# Altium project PR003.PrjPcb (part 2 of 11)

## Sheet TypeC_USB2.0.SchDoc
size A3; SheetNumber: 5; SheetTotal: 16
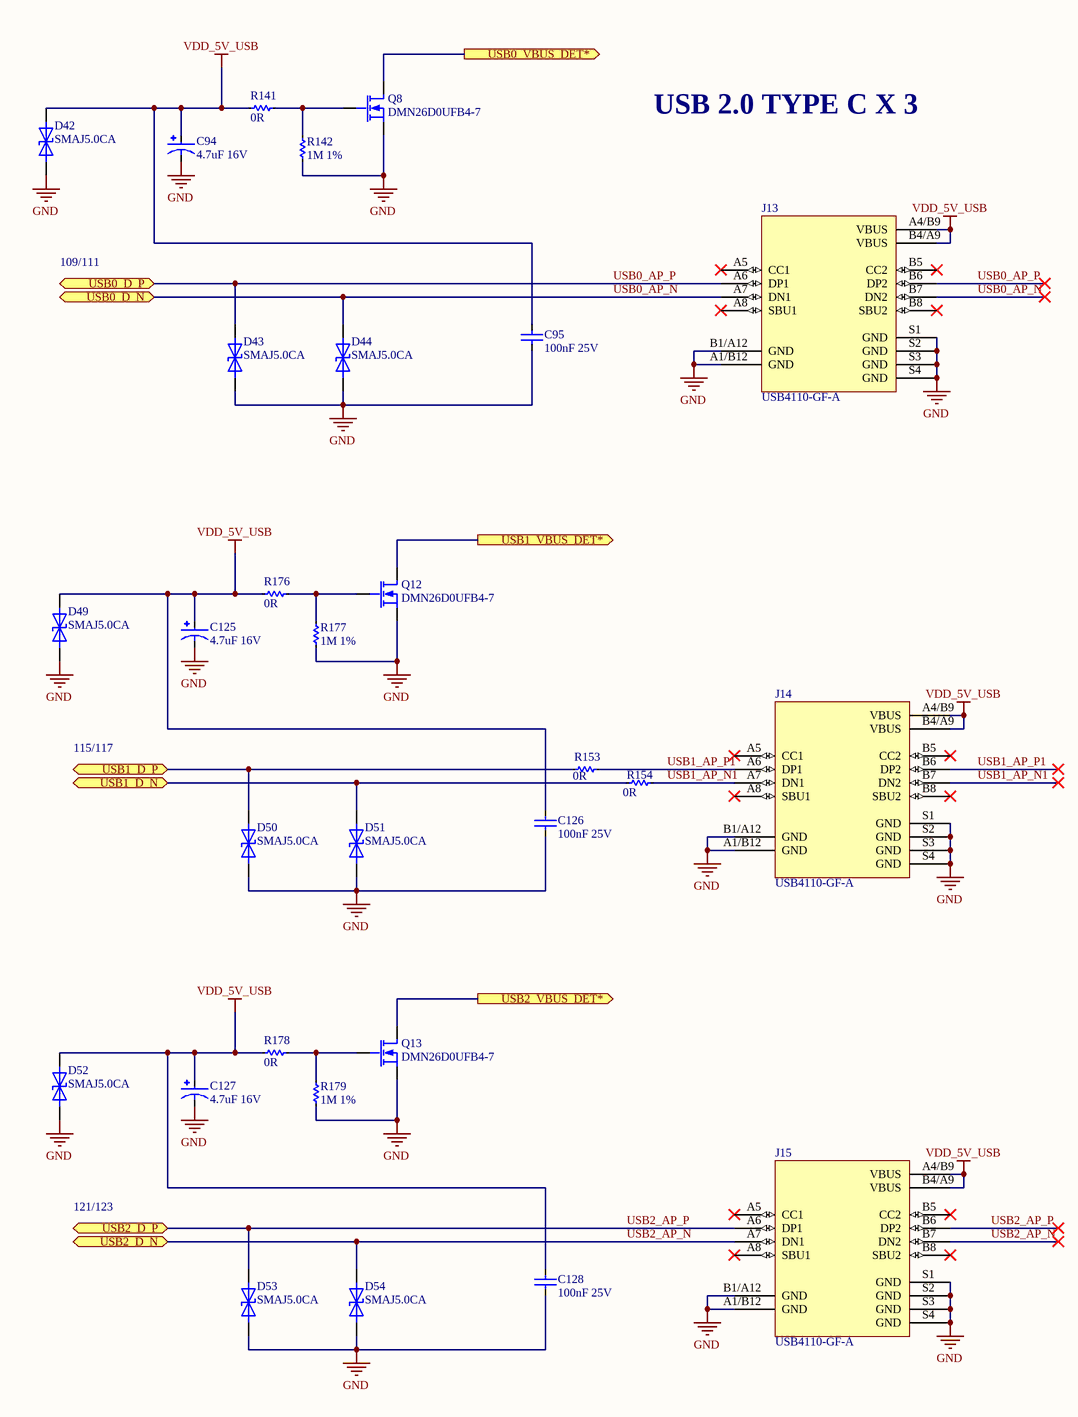
[diagram p3: TypeC_USB2.0.SchDoc]

### Parts
C94  4.7uF 16V  [C1206_TANTALUM]
C95  100nF 25V  [C0402]
C125  4.7uF 16V  [C1206_TANTALUM]
C126  100nF 25V  [C0402]
C127  4.7uF 16V  [C1206_TANTALUM]
C128  100nF 25V  [C0402]
D42  SMAJ5.0CA  [DO-214AC]
D43  SMAJ5.0CA  [DO-214AC]
D44  SMAJ5.0CA  [DO-214AC]
D49  SMAJ5.0CA  [DO-214AC]
D50  SMAJ5.0CA  [DO-214AC]
D51  SMAJ5.0CA  [DO-214AC]
D52  SMAJ5.0CA  [DO-214AC]
D53  SMAJ5.0CA  [DO-214AC]
D54  SMAJ5.0CA  [DO-214AC]
J13  USB4110-GF-A  [USB4110-GF-A]
J14  USB4110-GF-A  [USB4110-GF-A]
J15  USB4110-GF-A  [USB4110-GF-A]
Q8  DMN26D0UFB4-7  [DFN1006-3]
Q12  DMN26D0UFB4-7  [DFN1006-3]
Q13  DMN26D0UFB4-7  [DFN1006-3]
R141  0R  [R0603]
R142  1M 1%  [R0402]
R153  0R  [R0402]
R154  0R  [R0402]
R176  0R  [R0603]
R177  1M 1%  [R0402]
R178  0R  [R0603]
R179  1M 1%  [R0402]

### Ports
USB0_D_N (bidir), USB0_D_P (bidir), USB0_VBUS_DET* (out), USB1_D_N (bidir), USB1_D_P (bidir), USB1_VBUS_DET* (out), USB2_D_N (bidir), USB2_D_P (bidir), USB2_VBUS_DET* (out)

### Nets
GND: C94.2(-) C95.1 C125.2(-) C126.1 C127.2(-) C128.1 D42.C D43.C D44.C D49.C D50.C D51.C D52.C D53.C D54.C J13.A1/B12(GND) J13.B1/A12(GND) J13.S1(GND) J13.S2(GND) J13.S3(GND) J13.S4(GND) J14.A1/B12(GND) J14.B1/A12(GND) J14.S1(GND) J14.S2(GND) J14.S3(GND) J14.S4(GND) J15.A1/B12(GND) J15.B1/A12(GND) J15.S1(GND) J15.S2(GND) J15.S3(GND) J15.S4(GND) Q8.2(S) Q12.2(S) Q13.2(S) R142.1 R177.1 R179.1
VDD_5V_USB: C94.1(+1) C95.2 C125.1(+1) C126.2 C127.1(+1) C128.2 D42.A D49.A D52.A J13.A4/B9(VBUS) J13.B4/A9(VBUS) J14.A4/B9(VBUS) J14.B4/A9(VBUS) J15.A4/B9(VBUS) J15.B4/A9(VBUS) R141.1 R176.1 R178.1
USB0_AP_N: D44.A J13.A7(DN1) J13.B7(DN2) ; port USB0_D_N
USB0_AP_P: D43.A J13.A6(DP1) J13.B6(DP2) ; port USB0_D_P
USB1_AP_N1: J14.A7(DN1) J14.B7(DN2) R154.2
USB1_AP_P1: J14.A6(DP1) J14.B6(DP2) R153.2
USB1_D_N: D51.A R154.1 ; port USB1_D_N
USB1_D_P: D50.A R153.1 ; port USB1_D_P
USB2_AP_N: D54.A J15.A7(DN1) J15.B7(DN2) ; port USB2_D_N
USB2_AP_P: D53.A J15.A6(DP1) J15.B6(DP2) ; port USB2_D_P
NetJ10_87: Q8.3(D) ; port USB0_VBUS_DET*
NetJ10_128: Q12.3(D) ; port USB1_VBUS_DET*
NetJ10_130: Q13.3(D) ; port USB2_VBUS_DET*
NetQ8_1: Q8.1(G) R141.2 R142.2
NetQ12_1: Q12.1(G) R176.2 R177.2
NetQ13_1: Q13.1(G) R178.2 R179.2

Not connected (* = marked no-connect by the designer): J13 A5(CC1)* A8(SBU1)* B5(CC2)* B8(SBU2)*; J14 A5(CC1)* A8(SBU1)* B5(CC2)* B8(SBU2)*; J15 A5(CC1)* A8(SBU1)* B5(CC2)* B8(SBU2)*

### Notes on the sheet
- USB 2.0 TYPE C X 3
- 109/111
- 115/117
- 121/123

### Library data of the parts
C94 C125 C127 = TAJA475K016RNJ: Cap Tant Solid 4.7uF 16V A CASE 10%( 3.2 X 1.6 X 1.6mm) Inward L SMD 3216-18 4 Ohm 125C T/R; Manufacturer: Kyocera AVX; Dielectric Material: Tantalum; ESR (Equivalent Series Resistance): 4R; Leakage Current: 800nA; Polarity: Polar; Dissipation Factor: 6%; Supplier 1: Digi-Key; Manufacturer Part Number: TAJA475K016RNJ; RoHS: Yes; Category: Tantalum Capacitors; Stock 1: 746000; Pricing 1: 2000=0.09306, 4000=0.08789, 10000=0.08272, 14000=0.08014, 50000=0.07238, 100000=0.06721 (USD); Mount: Surface Mount,PCB; Case/Package: 1206; Number of Pins: 2; Case Code (Metric): 3216; Case Code (Imperial): 1206; Min Operating Temperature: -55°C; Max Operating Temperature: 125°C; Package Quantity: 2000; Capacitance: 4.7uF; Voltage Rating: 16V; Tolerance: 10%; Packaging: Tape and Reel; Voltage Rating (DC): 16V; Termination: SMD/SMT; Voltage: 16V; Features: General Purpose; Series: TAJ; Construction: Flat; Length: 3.2mm; Width: 1.6mm; Height: 1.6mm; Height - Seated (Max): 0.071inch; Depth: 1.6mm; Lead Pitch: 1.1mm; Radiation Hardening: No; Reach SVHC Compliant: Yes; Lead Free: Lead Free; RoHS Compliant: Yes; ComponentLink1URL: https://datasheet.ciiva.com/18710/taj-eng-18710646.pdf?src-supplier=Distrelec; ComponentLink1Description: https://datasheet.ciiva.com/18710/taj-eng-18710646.pdf?src-supplier=Distrelec; ComponentLink2URL: https://datasheet.ciiva.com/7914/taj-7914556.pdf?src-supplier=Element14; ComponentLink2Description: https://datasheet.ciiva.com/7914/taj-7914556.pdf?src-supplier=Element14; ComponentLink3URL: https://datasheet.ciiva.com/7914/taj-7914558.pdf?src-supplier=Element14; ComponentLink3Description: https://datasheet.ciiva.com/7914/taj-7914558.pdf?src-supplier=Element14; ComponentLink4URL: https://datasheet.ciiva.com/7914/1680476-7914555.pdf?src-supplier=Element14; ComponentLink4Description: https://datasheet.ciiva.com/7914/1680476-7914555.pdf?src-supplier=Element14; ComponentLink5URL: https://datasheet.ciiva.com/5934/13070-5934925.pdf?src-supplier=Farnell; ComponentLink5Description: https://datasheet.ciiva.com/5934/13070-5934925.pdf?src-supplier=Farnell; ComponentLink6URL: https://datasheet.ciiva.com/7914/13070-7914557.pdf?src-supplier=Element14; ComponentLink6Description: https://datasheet.ciiva.com/7914/13070-7914557.pdf?src-supplier=Element14; ComponentLink7URL: https://datasheet.ciiva.com/263/taj-263377.pdf?src-supplier=Digi-Key; ComponentLink7Description: https://datasheet.ciiva.com/263/taj-263377.pdf?src-supplier=Digi-Key; ComponentLink8URL: https://datasheet.ciiva.com/263/taj-263376.pdf?src-supplier=Digi-Key; ComponentLink8Description: https://datasheet.ciiva.com/263/taj-263376.pdf?src-supplier=Digi-Key; ComponentLink9URL: https://datasheet.ciiva.com/263/taj-263378.pdf?src-supplier=Digi-Key; ComponentLink9Description: https://datasheet.ciiva.com/263/taj-263378.pdf?src-supplier=Digi-Key; Supplier Part Number 1: 478-3868-2-ND
C95 C126 C128 = 04023C104KAT2A: 0402 100 nF 25 V ±10 % Tolerance X7R Surface Mount Multilayer Ceramic Capacitor; Manufacturer: Kyocera AVX; Tolerance: 10%; Supplier 1: Digi-Key; Manufacturer Part Number: 04023C104KAT2A; RoHS: Yes; Category: Ceramic Capacitors; Stock 1: 3248475; Pricing 1: 1=0.10000, 10=0.03300, 50=0.01820, 100=0.01480, 500=0.01060, 1000=0.00833, 2500=0.00758, 5000=0.00697 (USD); Mount: Surface Mount; Case/Package: 0402; Number of Pins: 2; Case Code (Metric): 1005; Case Code (Imperial): 0402; Min Operating Temperature: -55°C; Max Operating Temperature: 125°C; Capacitance: 100nF; Packaging: Cut Tape; Dielectric: X7R; Voltage Rating (DC): 25V; Voltage Rating: 25V; Package Quantity: 1; Termination: SMD/SMT; Voltage: 25V; Series: -; Construction: Flat; Length: 1mm; Width: 1mm; Thickness: 0.022inch; Depth: 0.5mm; Radiation Hardening: No; Reach SVHC Compliant: Yes; Lead Free: Lead Free; RoHS Compliant: Yes; ComponentLink1URL: https://datasheet.ciiva.com/1123/1679506-1123344.pdf?src-supplier=Element14; ComponentLink1Description: https://datasheet.ciiva.com/1123/1679506-1123344.pdf?src-supplier=Element14; ComponentLink2URL: https://datasheet.ciiva.com/7614/cx7r-7614663.pdf?src-supplier=Digi-Key; ComponentLink2Description: https://datasheet.ciiva.com/7614/cx7r-7614663.pdf?src-supplier=Digi-Key; ComponentLink3URL: https://datasheet.ciiva.com/7709/1679506-7709527.pdf?src-supplier=Element14; ComponentLink3Description: https://datasheet.ciiva.com/7709/1679506-7709527.pdf?src-supplier=Element14; ComponentLink4URL: https://datasheet.ciiva.com/6265/cx7r-6265272.pdf?src-supplier=Digi-Key; ComponentLink4Description: https://datasheet.ciiva.com/6265/cx7r-6265272.pdf?src-supplier=Digi-Key; ComponentLink5URL: https://datasheet.ciiva.com/14906/cx7r-14906223.pdf?src-supplier=Digi-Key; ComponentLink5Description: https://datasheet.ciiva.com/14906/cx7r-14906223.pdf?src-supplier=Digi-Key; Supplier Part Number 1: 478-7868-1-ND
D42-D44 D49-D54 = SMAJ5.0CA: Transient Voltage Suppressor, TVS, SMAJ Series, Bidirectional, 5 V, DO-214AC, 2, 6.4 V RoHS Compliant: Yes; Manufacturer: Littelfuse; Reverse Breakdown Voltage: 6.4V; Operating Supply Voltage: 5V; Max Surge Current: 43.5A; Number of Elements: 1; Clamping Voltage: 9.2V; Peak Pulse Power: 400W; Power Line Protection: No; Test Current: 10mA; Max Reverse Leakage Current: 800uA; Max Breakdown Voltage: 7V; Max Power Dissipation: 3.3W; Element Configuration: Single; Leakage Current: 1.6mA; Capacitance: 1.05nF; Diode Type: ZENER; Supplier 1: Digi-Key; Manufacturer Part Number: SMAJ5.0CA; RoHS: Yes; Category: TVS Diodes; Stock 1: 526420; Pricing 1: 1=0.43000, 10=0.32000, 100=0.19950, 500=0.13650, 1000=0.10500, 2000=0.09450 (USD); Mount: Surface Mount; Case/Package: DO-214AC; Number of Pins: 2; Min Operating Temperature: -65°C; Max Operating Temperature: 150°C; Package Quantity: 5000; Direction: Bidirectional; Packaging: Tape and Reel; Number of Bidirectional Channels: 1; Reverse Standoff Voltage: 5V; Min Breakdown Voltage: 6.4V; Breakdown Voltage: 6.4V; Number of Channels: 1; Polarity: Bidirectional; Termination: SMD/SMT; Peak Pulse Current: 43.5A; Power Dissipation: 400W; Voltage Rating (DC): 5V; Max Output Current: 43.5A; Resistor Type: Zener; Series: SMAJ; Clamping Voltage-Max: 9.2V; Length: 4.5mm; Width: 2.79mm; Height: 2.087mm; Radiation Hardening: No; Reach SVHC Compliant: Yes; Lead Free: Lead Free; RoHS Compliant: Yes; ComponentLink1URL: https://datasheet.ciiva.com/25624/0900766b810f4edb-25624837.pdf?src-supplier=Rs; ComponentLink1Description: https://datasheet.ciiva.com/25624/0900766b810f4edb-25624837.pdf?src-supplier=Rs; ComponentLink2URL: https://datasheet.ciiva.com/28473/607617-28473438.pdf?src-supplier=Element14; ComponentLink2Description: https://datasheet.ciiva.com/28473/607617-28473438.pdf?src-supplier=Element14; ComponentLink3URL: https://datasheet.ciiva.com/16206/littelfuse-tvs-diode-smaj-16206104.pdf?src-supplier=Future+Electronics; ComponentLink3Description: https://datasheet.ciiva.com/16206/littelfuse-tvs-diode-smaj-16206104.pdf?src-supplier=Future+Electronics; ComponentLink4URL: https://datasheet.ciiva.com/331/littelfuse-tvs-diode-smaj-datasheet-pdf-331055.pdf?src-supplier=Digi-Key; ComponentLink4Description: https://datasheet.ciiva.com/331/littelfuse-tvs-diode-smaj-datasheet-pdf-331055.pdf?src-supplier=Digi-Key; ComponentLink5URL: https://datasheet.ciiva.com/331/littelfuse-tvs-diode-smaj-datasheet-pdf-331056.pdf?src-supplier=Digi-Key; ComponentLink5Description: https://datasheet.ciiva.com/331/littelfuse-tvs-diode-smaj-datasheet-pdf-331056.pdf?src-supplier=Digi-Key; ComponentLink6URL: https://datasheet.ciiva.com/331/littelfuse-tvs-diode-smaj-datasheet-pdf-331054.pdf?src-supplier=Digi-Key; ComponentLink6Description: https://datasheet.ciiva.com/331/littelfuse-tvs-diode-smaj-datasheet-pdf-331054.pdf?src-supplier=Digi-Key; Supplier Part Number 1: SMAJ5.0CALFCT-ND
J13-J15 = USB4110-GF-A: Conn USB 2.0 Type C RCP 16 POS 0.3mm/0.5mm Solder ST SMD 16 Terminal 1 Port T/R; Manufacturer: Global Connector Technology; Gender: Receptacle; Mating Cycles: 10000; Shielding: Shielded; Number of Ports: 1; Supplier 1: Farnell; Manufacturer Part Number: USB4110-GF-A; RoHS: No; Category: USB Connectors; Stock 1: 3190; Pricing 1: 1=1.17000, 10=1.04000, 25=0.97800, 50=0.93500, 100=0.89200, 250=0.82000, 500=0.74800 (GBP); Mount: Surface Mount,Through Hole,Horizontal; Contact Plating: Gold; Insulation Color: Black; Min Operating Temperature: -40°C; Max Operating Temperature: 85°C; Connector Type: USB; Series: USB4110; Termination: Solder; Flammability Rating: UL94 V-0; ComponentLink1URL: https://gct.co/files/drawings/usb4110.pdf?src-supplier=Digi-Key; ComponentLink1Description: https://gct.co/files/drawings/usb4110.pdf?src-supplier=Digi-Key; Supplier Part Number 1: 3583367
Q8 Q12 Q13 = DMN26D0UFB4-7: Single N-Channel 20 V 350 mW Silicon Surface Mount Mosfet - DFN-3; Manufacturer: Diodes; Rise Time: 7.9ns; Rds On Max: 3R; Input Capacitance: 14.1pF; Continuous Drain Current (ID): 240mA; Drain to Source Resistance: 1.8R; Power Dissipation: 350mW; Turn-Off Delay Time: 13.4ns; Drain to Source Voltage (Vdss): 20V; Turn-On Delay Time: 3.8ns; Fall Time: 15.2ns; Number of Elements: 1; Gate to Source Voltage (Vgs): 10V; On-State Resistance: 10R; FET Type: 1 N-Channel; Supplier 1: Mouser; Manufacturer Part Number: DMN26D0UFB4-7; RoHS: Yes; Category: MOSFETs; Stock 1: 21043; Pricing 1: 1=0.38000, 10=0.32100, 50=0.32100, 100=0.17000, 1000=0.07700, 10000=0.05000 (USD); Mount: Surface Mount; Case/Package: DFN; Number of Pins: 3; Min Operating Temperature: -55°C; Max Operating Temperature: 150°C; Packaging: Tape and Reel; Package Quantity: 3000; Max Power Dissipation: 350mW; Element Configuration: Single; Number of Channels: 1; Polarity: N-CHANNEL; Series: -; Drain-source On Resistance-Max: 10R; Length: 1.05mm; Width: 0.65mm; Height: 0.35mm; Radiation Hardening: No; Reach SVHC Compliant: Yes; Lead Free: Lead Free; RoHS Compliant: Yes; ComponentLink1URL: https://datasheet.ciiva.com/4443/ds31775-89139-4443083.pdf?src-supplier=Mouser; ComponentLink1Description: https://datasheet.ciiva.com/4443/ds31775-89139-4443083.pdf?src-supplier=Mouser; ComponentLink2URL: https://datasheet.ciiva.com/11176/ds31775-11176556.pdf?src-supplier=Avnet; ComponentLink2Description: https://datasheet.ciiva.com/11176/ds31775-11176556.pdf?src-supplier=Avnet; ComponentLink3URL: https://datasheet.ciiva.com/16434/ds31775-16434037.pdf?src-supplier=Future+Electronics; ComponentLink3Description: https://datasheet.ciiva.com/16434/ds31775-16434037.pdf?src-supplier=Future+Electronics; ComponentLink4URL: https://datasheet.ciiva.com/48532/ds31775-48532486.pdf?src-supplier=Avnet; ComponentLink4Description: https://datasheet.ciiva.com/48532/ds31775-48532486.pdf?src-supplier=Avnet; ComponentLink5URL: https://datasheet.ciiva.com/934/ds31775-934573.pdf?src-supplier=Digi-Key; ComponentLink5Description: https://datasheet.ciiva.com/934/ds31775-934573.pdf?src-supplier=Digi-Key; ComponentLink6URL: https://datasheet.ciiva.com/934/ds31775-934574.pdf?src-supplier=Digi-Key; ComponentLink6Description: https://datasheet.ciiva.com/934/ds31775-934574.pdf?src-supplier=Digi-Key; ComponentLink7URL: https://datasheet.ciiva.com/934/ds31775-934572.pdf?src-supplier=Digi-Key; ComponentLink7Description: https://datasheet.ciiva.com/934/ds31775-934572.pdf?src-supplier=Digi-Key; Supplier Part Number 1: 621-DMN26D0UFB4-7
R141 R176 R178 = CR0603-J/-000ELF: RES SMD 0 OHM JUMPER 1/10W 0603; Manufacturer: Bourns; Resistance: 0mR; Power Rating: 100mW; Tolerance: 1%; Voltage Rating: 50V; Temperature Coefficient: 500ppm/°C; Resistance Tolerance: 5%; Supplier 1: Digi-Key; Manufacturer Part Number: CR0603-J/-000ELF; RoHS: Yes; Category: Chip SMD Resistors; Stock 1: 1690954; Pricing 1: 1=0.10000, 10=0.01300, 25=0.00960, 50=0.00720, 100=0.00540, 250=0.00408, 500=0.00328, 1000=0.00241 (USD); Mount: Surface Mount; Case/Package: 0603; Number of Pins: 2; Case Code (Imperial): 0603; Case Code (Metric): 1608; Contact Plating: Tin; Min Operating Temperature: -55°C; Max Operating Temperature: 155°C; Packaging: Tape and Reel; Package Quantity: 5000; Resistor Type: Thick Film; Termination: SMD/SMT; Max Power Dissipation: 100mW; Voltage Rating (DC): 50V; Series: CR0603; Technology: THICK FILM; Construction: Rectangular; Features: Moisture Resistant; Number of Terminations: 2; Length: 1.6mm; Width: 0.8mm; Height: 0.45mm; Depth: 0.8mm; Thickness: 457um; Radiation Hardening: No; Reach SVHC Compliant: Yes; Military Standard: Not; RoHS Compliant: Yes; ComponentLink1URL: https://datasheet.ciiva.com/11809/0900766b80fcdb72-11809586.pdf?src-supplier=RSComponents; ComponentLink1Description: https://datasheet.ciiva.com/11809/0900766b80fcdb72-11809586.pdf?src-supplier=RSComponents; ComponentLink2URL: https://datasheet.ciiva.com/7001/1902866-7001645.pdf?src-supplier=Newark; ComponentLink2Description: https://datasheet.ciiva.com/7001/1902866-7001645.pdf?src-supplier=Newark; ComponentLink3URL: https://datasheet.ciiva.com/7986/691949-7986171.pdf?src-supplier=Element14; ComponentLink3Description: https://datasheet.ciiva.com/7986/691949-7986171.pdf?src-supplier=Element14; ComponentLink4URL: https://datasheet.ciiva.com/7660/1856384-7660956.pdf?src-supplier=Element14; ComponentLink4Description: https://datasheet.ciiva.com/7660/1856384-7660956.pdf?src-supplier=Element14; ComponentLink5URL: https://datasheet.ciiva.com/22693/1902866-22693213.pdf?src-supplier=Element14; ComponentLink5Description: https://datasheet.ciiva.com/22693/1902866-22693213.pdf?src-supplier=Element14; ComponentLink6URL: https://datasheet.ciiva.com/5545/chpreztr-5545708.pdf?src-supplier=Mouser; ComponentLink6Description: https://datasheet.ciiva.com/5545/chpreztr-5545708.pdf?src-supplier=Mouser; ComponentLink7URL: https://datasheet.ciiva.com/16761/70154685-16761515.pdf?src-supplier=Allied+Electronics; ComponentLink7Description: https://datasheet.ciiva.com/16761/70154685-16761515.pdf?src-supplier=Allied+Electronics; ComponentLink8URL: https://datasheet.ciiva.com/30062/159chpreztr-30062601.pdf?src-supplier=Onlinecomponents.com; ComponentLink8Description: https://datasheet.ciiva.com/30062/159chpreztr-30062601.pdf?src-supplier=Onlinecomponents.com; ComponentLink9URL: https://datasheet.ciiva.com/48692/001055497-da-01-en-smd-wid-cr0603-j-000elf-0-0-ohm-1-10w-48692135.pdf?src-supplier=Conrad; ComponentLink9Description: https://datasheet.ciiva.com/48692/001055497-da-01-en-smd-wid-cr0603-j-000elf-0-0-ohm-1-10w-48692135.pdf?src-supplier=Conrad; Supplier Part Number 1: CR0603-J/-000ELFCT-ND
R142 R177 R179 = AC0402FR-071ML: RES SMD 1M OHM 1% 1/16W 0402; Manufacturer: Yageo; Power Rating: 62.5mW; Resistance: 1MR; Voltage Rating: 50V; Temperature Coefficient: 100ppm/°C; Max Power Dissipation: 63mW; Supplier 1: Digi-Key; Manufacturer Part Number: AC0402FR-071ML; RoHS: Yes; Category: Chip SMD Resistors; Stock 1: 684587; Pricing 1: 1=0.10000, 10=0.01900, 100=0.00790, 1000=0.00353, 2500=0.00307, 5000=0.00253 (USD); Case/Package: 0402; Case Code (Imperial): 0402; Case Code (Metric): 1005; Size Code: 0402; Min Operating Temperature: -55°C; Max Operating Temperature: 155°C; Packaging: Tape and Reel; Tolerance: 1%; Termination: SMD/SMT; Resistor Type: Thick Film; Number of Terminations: 2; Features: Moisture Resistant,Automotive AEC-Q200; Series: AC; Construction: Rectangular; Length: 1mm; Width: 0.5mm; Height: 0.015inch; Depth: 0.5mm; Military Standard: Not; Lead Free: Lead Free; RoHS Compliant: Yes; ComponentLink1URL: http://www.yageo.com/documents/recent/PYu-AC_51_RoHS_L_2.pdf?src-supplier=Mouser; ComponentLink1Description: http://www.yageo.com/documents/recent/PYu-AC_51_RoHS_L_2.pdf?src-supplier=Mouser; ComponentLink2URL: http://www.yageo.com/documents/recent/PYu-AC_51_RoHS_L_2_revised.pdf?src-supplier=Future+Electronics; ComponentLink2Description: http://www.yageo.com/documents/recent/PYu-AC_51_RoHS_L_2_revised.pdf?src-supplier=Future+Electronics; ComponentLink3URL: http://www.yageo.com/NewPortal/yageodocoutput?fileName=/pdf/R-Chip/PYu-AC_51_RoHS_L_6.pdf&src-supplier=Digi-Key; ComponentLink3Description: http://www.yageo.com/NewPortal/yageodocoutput?fileName=/pdf/R-Chip/PYu-AC_51_RoHS_L_6.pdf&src-supplier=Digi-Key; Supplier Part Number 1: YAG3450CT-ND
R153 R154 = RC0402JR-070RP: Res Jumper Thick Film 0402 0 Ohm 5% 1/16W Molded SMD Paper T/R; Manufacturer: Yageo; Resistance: 0mR; Max Power Dissipation: 63mW; Supplier 1: Digi-Key; Manufacturer Part Number: RC0402JR-070RP; RoHS: Yes; Category: Chip SMD Resistors; Stock 1: 5886851; Pricing 1: 1=0.10000, 10=0.02300, 25=0.01640, 50=0.01240, 100=0.00920, 250=0.00700, 500=0.00560, 1000=0.00412, 5000=0.00296 (USD); Case/Package: 0402; Case Code (Metric): 1005; Case Code (Imperial): 0402; Min Operating Temperature: -55°C; Max Operating Temperature: 155°C; Packaging: Tape and Reel; Resistor Type: Thick Film; Number of Terminations: 2; Features: Moisture Resistant; Length: 0.039inch; Width: 0.02inch; Height: 0.016inch; RoHS Compliant: Yes; ComponentLink1URL: http://www.yageo.com/NewPortal/yageodocoutput?fileName=/pdf/R-Chip/PYu-RC_51_RoHS_P_0.pdf&src-supplier=Digi-Key; ComponentLink1Description: http://www.yageo.com/NewPortal/yageodocoutput?fileName=/pdf/R-Chip/PYu-RC_51_RoHS_P_0.pdf&src-supplier=Digi-Key; Supplier Part Number 1: YAG1279CT-ND

## Sheet USB3.2_Type_A.SchDoc
size A3; SheetNumber: 6; SheetTotal: 16
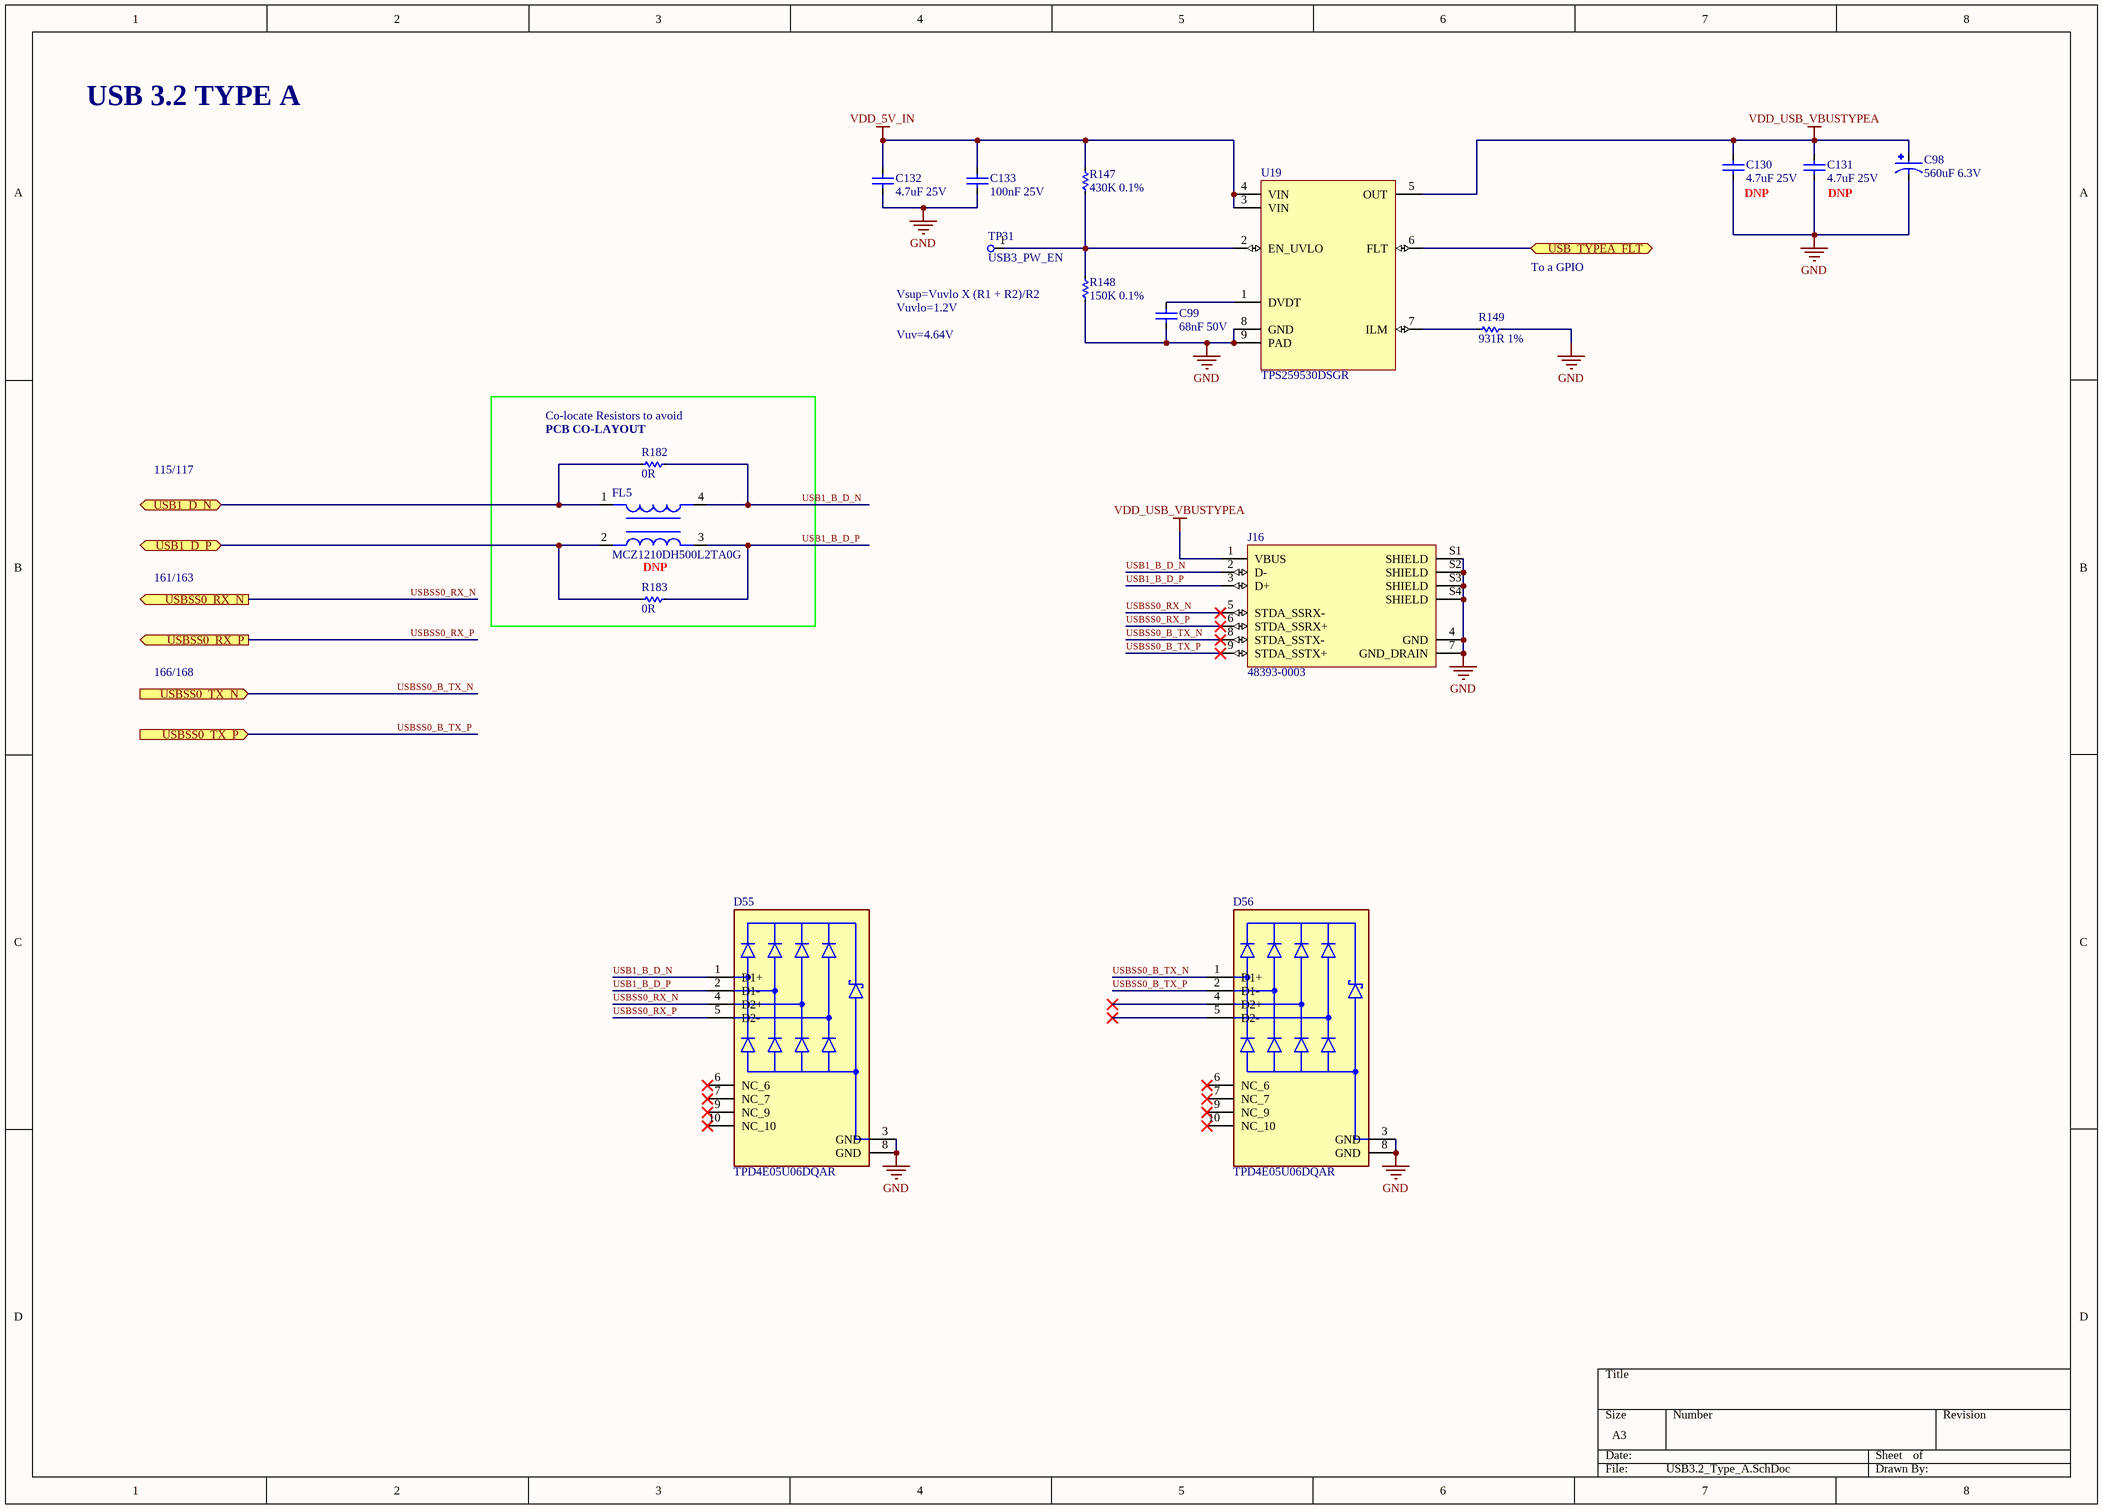
[diagram p4: USB3.2_Type_A.SchDoc]

### Parts
C98  560uF 6.3V  [CP_ELEC_8X7.7]
C99  68nF 50V  [C0805]
C130  4.7uF 25V  [C0603]
C131  4.7uF 25V  [C0603]
C132  4.7uF 25V  [C0603]
C133  100nF 25V  [C0402]
D55  TPD4E05U06DQAR  [TPD4E05U06DQAR]
D56  TPD4E05U06DQAR  [TPD4E05U06DQAR]
FL5  MCZ1210DH500L2TA0G  [MCZ1210DH500L2TA0G]
J16  48393-0003  [0483930003]
R147  430K 0.1%  [R0603]
R148  150K 0.1%  [R0402]
R149  931R 1%  [R0402]
R182  0R  [R0402]
R183  0R  [R0402]
TP31  USB3_PW_EN  [TestPoint_Pad_D1.0mm]
U19  TPS259530DSGR  [WSON(2X2)-8]

### Ports
USB1_D_N (bidir), USB1_D_P (bidir), USB_TYPEA_FLT (bidir), USBSS0_RX_N (out), USBSS0_RX_P (out), USBSS0_TX_N (in), USBSS0_TX_P (in)

### Nets
GND: C98.2(C) C99.1 C130.1 C131.1 C132.1 C133.1 D55.3(GND) D55.8(GND) D56.3(GND) D56.8(GND) J16.4(GND) J16.7(GND_DRAIN) J16.S1(SHIELD) J16.S2(SHIELD) J16.S3(SHIELD) J16.S4(SHIELD) R148.1 R149.2 U19.8(GND) U19.9(PAD)
VDD_5V_IN: C132.2 C133.2 R147.2 U19.3(VIN) U19.4(VIN)
VDD_USB_VBUSTYPEA: C98.1(A) C130.2 C131.2 J16.1(VBUS) U19.5(OUT)
USB1_B_D_N: D55.1(D1+) FL5.4 J16.2(D-) R182.2
USB1_B_D_P: D55.2(D1-) FL5.3 J16.3(D+) R183.2
USB1_D_N: FL5.1 R182.1 ; port USB1_D_N
USB1_D_P: FL5.2 R183.1 ; port USB1_D_P
USB_TYPEA_FLT: U19.6(FLT) ; port USB_TYPEA_FLT
USBSS0_B_TX_N: D56.1(D1+) J16.8(STDA_SSTX-) ; port USBSS0_TX_N
USBSS0_B_TX_P: D56.2(D1-) J16.9(STDA_SSTX+) ; port USBSS0_TX_P
USBSS0_RX_N: D55.4(D2+) J16.5(STDA_SSRX-) ; port USBSS0_RX_N
USBSS0_RX_P: D55.5(D2-) J16.6(STDA_SSRX+) ; port USBSS0_RX_P
NetC99_2: C99.2 U19.1(DVDT)
NetR147_1: R147.1 R148.2 TP31.1 U19.2(EN_UVLO)
NetR149_1: R149.1 U19.7(ILM)

Not connected (* = marked no-connect by the designer): D55 6(NC_6)* 7(NC_7)* 9(NC_9)* 10(NC_10)*; D56 4(D2+)* 5(D2-)* 6(NC_6)* 7(NC_7)* 9(NC_9)* 10(NC_10)*

### Notes on the sheet
- USB 3.2 TYPE A
- (near C130) DNP
- (near C131) DNP
- Vsup=Vuvlo X (R1 + R2)/R2
- Vuvlo=1.2V
- To a GPIO
- Vuv=4.64V
- (near R182) Co-locate Resistors to avoid
- (near R182) PCB CO-LAYOUT
- 115/117
- 161/163
- DNP
- 166/168

### Library data of the parts
C98 = RHA0J561MCN1GS: Cap Aluminum Polymer 560uF 6.3VDC 20% (8 X 7.7mm) SMD 0.009 Ohm 4500mA 2000h 105C T/R; Manufacturer: Nichicon; ESR (Equivalent Series Resistance): 9mR; Life (Hours): 2000Hour; Ripple Current: 4.5A; Leakage Current: 1.0584mA; Dissipation Factor: 0.12%; Supplier 1: Digi-Key; Manufacturer Part Number: RHA0J561MCN1GS; RoHS: Yes; Category: Polymer Capacitors; Stock 1: 37081; Pricing 1: 1=1.16000, 10=0.88500, 50=0.73500, 100=0.63290 (USD); Mount: Surface Mount; Case/Package: Radial; Min Operating Temperature: -55°C; Max Operating Temperature: 105°C; Capacitance: 560uF; Tolerance: 20%; Voltage Rating: 6.3V; Packaging: Tape and Reel; Package Quantity: 1; Voltage Rating (DC): 6.3V; Termination: SMD/SMT; Series: FPCAP, HA; Construction: Cylindrical; Diameter: 8mm; Length: 7.7mm; Width: 8.3mm; Height: 8.3mm; Height - Seated (Max): 0.303inch; Radiation Hardening: No; RoHS Compliant: Yes; ComponentLink1URL: https://datasheet.ciiva.com/16481/2009fpcap-catalog-hsha-16481370.pdf?src-supplier=Future+Electronics; ComponentLink1Description: https://datasheet.ciiva.com/16481/2009fpcap-catalog-hsha-16481370.pdf?src-supplier=Future+Electronics; ComponentLink2URL: https://datasheet.ciiva.com/101/e-hs-ha-101946.pdf?src-supplier=Digi-Key; ComponentLink2Description: https://datasheet.ciiva.com/101/e-hs-ha-101946.pdf?src-supplier=Digi-Key; ComponentLink3URL: https://datasheet.ciiva.com/101/e-hs-ha-101947.pdf?src-supplier=Digi-Key; ComponentLink3Description: https://datasheet.ciiva.com/101/e-hs-ha-101947.pdf?src-supplier=Digi-Key; ComponentLink4URL: https://datasheet.ciiva.com/101/e-hs-ha-101948.pdf?src-supplier=Digi-Key; ComponentLink4Description: https://datasheet.ciiva.com/101/e-hs-ha-101948.pdf?src-supplier=Digi-Key; Supplier Part Number 1: 493-3772-1-ND
C99 = C0805C683K5RECAUTO7210: Cap Cer 0805 68NF 50V X7R 10%; Manufacturer: KEMET; Supplier 1: Digi-Key; Manufacturer Part Number: C0805C683K5RECAUTO7210; Category: Ceramic Capacitors; Stock 1: 10000; Pricing 1: 1=0.25000, 10=0.17100, 50=0.11400, 100=0.09680, 500=0.06836, 1000=0.05981, 2500=0.05696, 5000=0.05269 (USD); RoHS Compliant: Yes; ComponentLink1URL: https://api.kemet.com/component-edge/download/datasheet/C0805C683K5RECAUTO7210.pdf?src-supplier=Digi-Key; ComponentLink1Description: https://api.kemet.com/component-edge/download/datasheet/C0805C683K5RECAUTO7210.pdf?src-supplier=Digi-Key; Supplier Part Number 1: 399-C0805C683K5RECAUTO7210CT-ND
C130-C132 = GRM188R61E475KE11D: 0603 4.7 uF 25 V ±10 % Tolerance X5R SMT Multilayer Ceramic Capacitor; Manufacturer: Murata; Tolerance: 10%; Supplier 1: Digi-Key; Manufacturer Part Number: GRM188R61E475KE11D; RoHS: Yes; Category: Ceramic Capacitors; Stock 1: 1144167; Pricing 1: 1=0.26000, 10=0.18000, 50=0.12000, 100=0.10200, 500=0.07202, 1000=0.06301 (USD); Mount: Surface Mount; Case/Package: 0603; Case Code (Metric): 1608; Case Code (Imperial): 0603; Material: Ceramic; Min Operating Temperature: -55°C; Max Operating Temperature: 85°C; Package Quantity: 1; Packaging: Cut Tape; Capacitance: 4.7uF; Voltage Rating: 25V; Dielectric: X5R; Voltage: 25V; Voltage Rating (DC): 25V; Series: GRM; Length: 0.063inch; Width: 0.031inch; Height: 0.8mm; Thickness: 0.031inch; Depth: 0.8mm; Reach SVHC Compliant: Yes; Lead Free: Lead Free; RoHS Compliant: Yes; ComponentLink1URL: https://datasheet.ciiva.com/46444/1769893-46444983.pdf?src-supplier=Element14; ComponentLink1Description: https://datasheet.ciiva.com/46444/1769893-46444983.pdf?src-supplier=Element14; ComponentLink2URL: https://datasheet.ciiva.com/46444/1769893-46444982.pdf?src-supplier=Element14; ComponentLink2Description: https://datasheet.ciiva.com/46444/1769893-46444982.pdf?src-supplier=Element14; ComponentLink3URL: https://datasheet.ciiva.com/14891/partnumbering-e-01-14891103.pdf?src-supplier=Digi-Key; ComponentLink3Description: https://datasheet.ciiva.com/14891/partnumbering-e-01-14891103.pdf?src-supplier=Digi-Key; ComponentLink4URL: https://datasheet.ciiva.com/14891/partnumbering-e-01-14891102.pdf?src-supplier=Digi-Key; ComponentLink4Description: https://datasheet.ciiva.com/14891/partnumbering-e-01-14891102.pdf?src-supplier=Digi-Key; Supplier Part Number 1: 490-7203-1-ND
C133 = TMK105BJ104KV-F: as C123 on sheet Block_HDMI, DP, DSI, USBSS and PCIe; Supplier 1: Digi-Key; Manufacturer Part Number: TMK105BJ104KV-F; RoHS: Yes; Category: Ceramic Capacitors; Stock 1: 11997960; Pricing 1: 1=0.10000, 10=0.03700, 50=0.02000, 100=0.01630, 500=0.01166, 1000=0.00917, 2500=0.00833, 5000=0.00767 (USD); Mount: Surface Mount; Case/Package: 0402; Number of Pins: 2; Case Code (Imperial): 0402; Case Code (Metric): 1005; Weight: 2.3E-05oz; Min Operating Temperature: -55°C; Max Operating Temperature: 85°C; Capacitance: 100nF; Packaging: Tape and Reel; Dielectric: X5R; Voltage Rating (DC): 25V; Voltage Rating: 25V; Package Quantity: 1; Termination: SMD/SMT; Resistor Type: Ceramic; Voltage: 25V; Series: M; Construction: Flat; Length: 1mm; Width: 0.02inch; Height: 0.5mm; Depth: 0.5mm; Thickness: 0.022inch; Reach SVHC Compliant: Yes; Lead Free: Lead Free; Halogen Free: Halogen Free; RoHS Compliant: Yes; Supplier Part Number 1: 587-1456-1-ND
D55 D56 = TPD4E05U06DQAR: Quad 0.5-pF, 5.5-V, ±12-kV ESD protection diode for USB, HDMI & High Speed Interfaces; Manufacturer: Texas Instruments; Direction: Unidirectional; Capacitance: 0.5pF; Number of Bidirectional Channels: 4; Reverse Standoff Voltage: 5.5V; Min Breakdown Voltage: 6V; Clamping Voltage: 14V; Peak Pulse Power: 40W; Power Line Protection: Yes; Leakage Current: 10nA; Peak Pulse Current: 2.5A; Interface: LVDS,USB,Ethernet,HDMI,PCIe,SATA; Supplier 1: Mouser; Manufacturer Part Number: TPD4E05U06DQAR; RoHS: Yes; Category: Integrated Circuits (ICs); Stock 1: 71744; Pricing 1: 1=0.66000, 10=0.58100, 50=0.54600, 100=0.44600, 1000=0.28200, 10000=0.25500 (USD); Mount: Surface Mount; Case/Package: SON; Number of Pins: 10; Contact Plating: Gold; Min Operating Temperature: -40°C; Max Operating Temperature: 125°C; Packaging: Tape and Reel; Package Quantity: 3000; Polarity: Unidirectional; Number of Channels: 4; Breakdown Voltage: 6V; Max Power Dissipation: 40W; Termination: SMD/SMT; Working Voltage: 5.5V; Operating Supply Voltage: 5.5V; Series: -; Number of Unidirectional Channels: 4; Length: 2.6mm; Depth: 1.1mm; Radiation Hardening: No; Reach SVHC Compliant: Yes; Lead Free: Lead Free; RoHS Compliant: Yes; ComponentLink1URL: https://datasheet.ciiva.com/15063/tpd4e05u06-15063653.pdf?src-supplier=Digi-Key; ComponentLink1Description: https://datasheet.ciiva.com/15063/tpd4e05u06-15063653.pdf?src-supplier=Digi-Key; ComponentLink2URL: https://datasheet.ciiva.com/24119/slvsbo7f-316827-24119436.pdf?src-supplier=Mouser; ComponentLink2Description: https://datasheet.ciiva.com/24119/slvsbo7f-316827-24119436.pdf?src-supplier=Mouser; ComponentLink3URL: https://datasheet.ciiva.com/26918/getdatasheetpartid-716763-26918024.pdf?src-supplier=Verical; ComponentLink3Description: https://datasheet.ciiva.com/26918/getdatasheetpartid-716763-26918024.pdf?src-supplier=Verical; ComponentLink4URL: https://datasheet.ciiva.com/15063/tpd4e05u06-15063654.pdf?src-supplier=Digi-Key; ComponentLink4Description: https://datasheet.ciiva.com/15063/tpd4e05u06-15063654.pdf?src-supplier=Digi-Key; ComponentLink5URL: https://datasheet.ciiva.com/15063/tpd4e05u06-15063655.pdf?src-supplier=Digi-Key; ComponentLink5Description: https://datasheet.ciiva.com/15063/tpd4e05u06-15063655.pdf?src-supplier=Digi-Key; ComponentLink6URL: https://datasheet.ciiva.com/29883/tpd4e05u06-29883798.pdf?src-supplier=Avnet; ComponentLink6Description: https://datasheet.ciiva.com/29883/tpd4e05u06-29883798.pdf?src-supplier=Avnet; Supplier Part Number 1: 595-TPD4E05U06DQAR
FL5 = MCZ1210DH500L2TA0G: 2 Line Common Mode Choke Surface Mount 50 Ohms 100mA DCR 2.5Ohm; Manufacturer: TDK; Number of Lines: 2; DC Resistance (DCR): 2.5R; Voltage Rating (DC): 5V; Supplier 1: Mouser; Manufacturer Part Number: MCZ1210DH500L2TA0G; RoHS: Yes; Category: Common Mode Chokes; Stock 1: 8170; Pricing 1: 1=0.64000, 10=0.62200, 50=0.62200, 100=0.49900, 1000=0.33900, 10000=0.24500 (USD); Mount: Surface Mount; Case Code (Metric): 3225; Case Code (Imperial): 1210; Min Operating Temperature: -40°C; Max Operating Temperature: 85°C; Packaging: Tape and Reel; Max Current Rating: 100mA; Length: 0.049inch; Width: 0.039inch; Height: 0.024inch; RoHS Compliant: Yes; ComponentLink1URL: https://product.tdk.com/info/en/catalog/datasheets/cmf_commercial_signal_mcz1210dh_en.pdf?ref_disty=digikey&src-supplier=Digi-Key; ComponentLink1Description: https://product.tdk.com/info/en/catalog/datasheets/cmf_commercial_signal_mcz1210dh_en.pdf?ref_disty=digikey&src-supplier=Digi-Key; Supplier Part Number 1: 810-MCZ1210DH500L2TG
J16 = 48393-0003: Conn USB Type A F 9 POS 2mm/2.5mm Solder RA Thru-Hole 9 Terminal 1 Port Embossed T/R; Manufacturer: Molex; Number of Terminals/Pins: 9; Gender: Receptacle; Number of Ports: 1; Max Voltage Rating (AC): 30V; Current Rating: 1.8A; USB Standard: USB 3.0; Supplier 1: Digi-Key; Manufacturer Part Number: 48393-0003; RoHS: Yes; Category: USB Connectors; Stock 1: 39734; Pricing 1: 1=4.18000, 10=3.67900, 100=2.92660 (USD); Mount: Through Hole; Contact Plating: Gold,Tin,Matte; Contact Material: Copper,Copper Alloy; Housing Material: Thermoplastic; Min Operating Temperature: -20°C; Max Operating Temperature: 85°C; Connector Type: USB; Number of Contacts: 9; Termination: Solder; Packaging: Tape and Reel; Voltage Rating: 30V; Orientation: Right Angle; Number of Circuits: 9; Series: 48393; Length: 13.8mm; Depth: 14.25mm; Halogen Free: Low Halogen; ComponentLink1URL: https://datasheet.ciiva.com/46420/1789526-46420565.pdf?src-supplier=Element14; ComponentLink1Description: https://datasheet.ciiva.com/46420/1789526-46420565.pdf?src-supplier=Element14; ComponentLink2URL: https://datasheet.ciiva.com/46420/1789526-46420566.pdf?src-supplier=Element14; ComponentLink2Description: https://datasheet.ciiva.com/46420/1789526-46420566.pdf?src-supplier=Element14; ComponentLink3URL: https://datasheet.ciiva.com/46420/1789526-46420586.pdf?src-supplier=Element14; ComponentLink3Description: https://datasheet.ciiva.com/46420/1789526-46420586.pdf?src-supplier=Element14; Supplier Part Number 1: WM10413CT-ND
R147 = CPF0603B430KE1: Res Thin Film 0603 430K Ohm 0.1% 1/16W ±25ppm/°C Molded SMD SMD Paper T/R; Manufacturer: TE Connectivity; Resistance: 430kR; Power Rating: 63mW; Voltage Rating: 50V; Number of Resistors: 1; Supplier 1: Digi-Key; Manufacturer Part Number: CPF0603B430KE1; RoHS: Yes; Category: Chip SMD Resistors; Stock 1: 37540; Pricing 1: 1=0.69000, 10=0.49000, 100=0.25450, 500=0.17622 (USD); Mount: Surface Mount; Case/Package: 0603; Case Code (Imperial): 0603; Case Code (Metric): 1608; Weight: 7.1E-05oz; Min Operating Temperature: -55°C; Max Operating Temperature: 155°C; Tolerance: 0.1%; Packaging: Tape and Reel; Resistor Type: Thin Film; Package Quantity: 1000; Termination: Solder; Temperature Coefficient: 25ppm/°C; Voltage Rating (DC): 50V; Number of Terminations: 2; Series: CPF, Neohm; Resistance Tolerance: 0.1%; Max Power Dissipation: 63mW; Length: 1.55mm; Width: 0.8mm; Height: 0.45mm; Reach SVHC Compliant: Yes; ELV: Compliant; RoHS Compliant: Yes; ComponentLink1URL: https://datasheet.ciiva.com/30239/29261eng-ds-1773200-f-30239597.pdf?src-supplier=Onlinecomponents.com; ComponentLink1Description: https://datasheet.ciiva.com/30239/29261eng-ds-1773200-f-30239597.pdf?src-supplier=Onlinecomponents.com; ComponentLink2URL: https://datasheet.ciiva.com/22670/1723857-22670871.pdf?src-supplier=Element14; ComponentLink2Description: https://datasheet.ciiva.com/22670/1723857-22670871.pdf?src-supplier=Element14; ComponentLink3URL: https://datasheet.ciiva.com/12794/eng-ds-1773200-i-12794055.pdf?src-supplier=Mouser; ComponentLink3Description: https://datasheet.ciiva.com/12794/eng-ds-1773200-i-12794055.pdf?src-supplier=Mouser; Supplier Part Number 1: A102274CT-ND
R148 = RT0402BRD07150KL: Res Thin Film 0402 150K Ohm 0.1% 1/16W ±25ppm/°C Molded SMD; Manufacturer: Yageo; Supplier 1: Digi-Key; Manufacturer Part Number: RT0402BRD07150KL; RoHS: Yes; Category: Chip SMD Resistors; Stock 1: 19814; Pricing 1: 1=0.47000, 10=0.33800, 100=0.13500, 500=0.09198, 1000=0.06654, 2500=0.06165, 5000=0.05578 (USD); RoHS Compliant: Yes; Supplier Part Number 1: 13-RT0402BRD07150KLCT-ND
R149 = RC0402FR-07931RL: Res Thick Film 0402 931 Ohm 1% 1/16W ±100ppm/°C Molded SMD Paper T/R; Manufacturer: Yageo; Voltage Rating: 50V; Power Rating: 62.5mW; Max Power Dissipation: 63mW; Supplier 1: Digi-Key; Manufacturer Part Number: RC0402FR-07931RL; RoHS: Yes; Category: Chip SMD Resistors; Stock 1: 184106; Pricing 1: 1=0.10000, 10=0.01400, 100=0.00580, 1000=0.00262, 2500=0.00228, 5000=0.00188 (USD); Case/Package: 0402; Case Code (Imperial): 0402; Case Code (Metric): 1005; Contact Plating: Tin,Matte; Size Code: 0402; Min Operating Temperature: -55°C; Max Operating Temperature: 155°C; Resistance: 931R; Tolerance: 1%; Packaging: Tape and Reel; Resistor Type: Thick Film; Number of Terminations: 2; Termination: SMD/SMT; Temperature Coefficient: 100ppm/°C; Voltage Rating (DC): 50V; Features: Moisture Resistant; Series: RC; Construction: Rectangular; Length: 1mm; Width: 0.02inch; Height: 0.016inch; Depth: 0.5mm; Military Standard: Not; Lead Free: Lead Free; RoHS Compliant: Yes; ComponentLink1URL: https://datasheet.ciiva.com/16931/pyu-rc0402-51-rohs-l-6-r-16931231.pdf?src-supplier=Future+Electronics; ComponentLink1Description: https://datasheet.ciiva.com/16931/pyu-rc0402-51-rohs-l-6-r-16931231.pdf?src-supplier=Future+Electronics; Supplier Part Number 1: YAG3259CT-ND
R182 R183 = RC0402JR-070RP: as R153 on sheet TypeC_USB2.0; Supplier 1: Digi-Key; Manufacturer Part Number: RC0402JR-070RP; RoHS: Yes; Category: Chip SMD Resistors; Stock 1: 5886851; Pricing 1: 1=0.10000, 10=0.02300, 25=0.01640, 50=0.01240, 100=0.00920, 250=0.00700, 500=0.00560, 1000=0.00412, 5000=0.00296 (USD); Case/Package: 0402; Case Code (Metric): 1005; Case Code (Imperial): 0402; Min Operating Temperature: -55°C; Max Operating Temperature: 155°C; Packaging: Tape and Reel; Resistor Type: Thick Film; Number of Terminations: 2; Features: Moisture Resistant; Length: 0.039inch; Width: 0.02inch; Height: 0.016inch; RoHS Compliant: Yes; ComponentLink1URL: http://www.yageo.com/NewPortal/yageodocoutput?fileName=/pdf/R-Chip/PYu-RC_51_RoHS_P_0.pdf&src-supplier=Digi-Key; ComponentLink1Description: http://www.yageo.com/NewPortal/yageodocoutput?fileName=/pdf/R-Chip/PYu-RC_51_RoHS_P_0.pdf&src-supplier=Digi-Key; Supplier Part Number 1: YAG1279CT-ND
TP31 = TestPoint_D1mm
U19 = TPS259530DSGR: TPS259530 12V eFuse with Fast Overvoltage Protection 2.7V to 18V 4A 34m Ohm 8-Pin WSON T/R; Manufacturer: Texas Instruments; Number of Channels: 1; Accuracy: 7.5%; Supplier 1: Mouser; Manufacturer Part Number: TPS259530DSGR; RoHS: Yes; Category: Integrated Circuits (ICs); Stock 1: 11629; Pricing 1: 1=0.97000, 10=0.87000, 50=0.82500, 100=0.67800, 1000=0.44200, 10000=0.42700 (USD); Mount: Surface Mount; Min Operating Temperature: -40°C; Max Operating Temperature: 125°C; Packaging: Tape and Reel; Output Current: 4A; RoHS Compliant: Yes; ComponentLink1URL: https://www.ti.com/lit/ds/symlink/tps2595.pdf?ts=1676530042371&ref_url=https%253A%252F%252Fwww.ti.com%252Fproduct%252FTPS2595%252Fpart-details%252FTPS259530DSGR; ComponentLink1Description: Datasheet; Supplier Part Number 1: 595-TPS259530DSGR